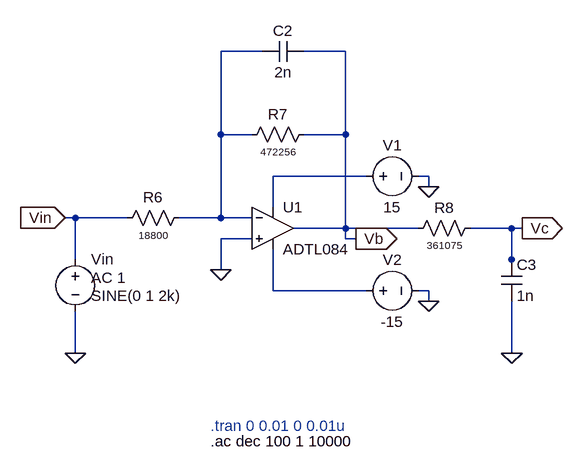
[diagram p0: schematic 2nd Order LPF.asc]
2nd Order LPF.asc, the LTspice schematic file:
Version 4
SHEET 1 880 680
WIRE 368 -176 304 -176
WIRE 496 -176 432 -176
WIRE 304 -48 304 -176
WIRE 352 -48 304 -48
WIRE 496 -48 496 -176
WIRE 496 -48 432 -48
WIRE 528 16 384 16
WIRE 624 16 608 16
WIRE 624 32 624 16
WIRE 384 64 384 16
WIRE 80 80 64 80
WIRE 160 80 80 80
WIRE 304 80 304 -48
WIRE 304 80 240 80
WIRE 352 80 304 80
WIRE 496 96 496 -48
WIRE 496 96 416 96
WIRE 608 96 496 96
WIRE 752 96 688 96
WIRE 768 96 752 96
WIRE 352 112 304 112
WIRE 496 112 496 96
WIRE 512 112 496 112
WIRE 80 144 80 80
WIRE 752 144 752 96
WIRE 304 160 304 112
WIRE 752 160 752 144
WIRE 384 192 384 128
WIRE 528 192 384 192
WIRE 624 192 608 192
WIRE 624 208 624 192
WIRE 80 288 80 224
WIRE 752 288 752 208
FLAG 80 288 0
FLAG 304 160 0
FLAG 752 288 0
FLAG 624 208 0
FLAG 624 32 0
FLAG 768 96 Vc
IOPIN 768 96 Out
FLAG 512 112 Vb
IOPIN 512 112 Out
FLAG 64 80 Vin
IOPIN 64 80 In
SYMBOL res 256 64 R90
WINDOW 0 0 56 VBottom 2
WINDOW 3 32 56 VTop 1
SYMATTR InstName R6
SYMATTR Value 18800
SYMBOL voltage 80 128 R0
WINDOW 3 24 72 Left 2
WINDOW 123 24 44 Left 2
WINDOW 39 0 0 Left 0
SYMATTR Value SINE(0 1 2k)
SYMATTR Value2 AC 1
SYMATTR InstName Vin
SYMBOL res 448 -64 R90
WINDOW 0 0 56 VBottom 2
WINDOW 3 32 56 VTop 1
SYMATTR InstName R7
SYMATTR Value 472256
SYMBOL cap 432 -192 R90
WINDOW 0 0 32 VBottom 2
WINDOW 3 32 32 VTop 2
SYMATTR InstName C2
SYMATTR Value 2n
SYMBOL res 704 80 R90
WINDOW 0 0 56 VBottom 2
WINDOW 3 32 56 VTop 1
SYMATTR InstName R8
SYMATTR Value 361075
SYMBOL cap 736 144 R0
SYMATTR InstName C3
SYMATTR Value 1n
SYMBOL voltage 512 16 R270
WINDOW 0 32 56 VTop 2
WINDOW 3 -32 56 VBottom 2
WINDOW 123 0 0 Left 0
WINDOW 39 0 0 Left 0
SYMATTR InstName V1
SYMATTR Value 15
SYMBOL voltage 512 192 R270
WINDOW 0 32 56 VTop 2
WINDOW 3 -32 56 VBottom 2
SYMATTR InstName V2
SYMATTR Value -15
SYMBOL OpAmps\\ADTL084 384 32 R0
SYMATTR InstName U1
TEXT 288 400 Left 2 ;.tran 0 0.01 0 0.01u
TEXT 288 424 Left 2 !.ac dec 100 1 10000

The netlist it stands for:
* 2nd Order LPF.asc
R6 N001 Vin 18800
Vin Vin 0 SINE(0 1 2k) AC 1
R7 Vb N001 472256
C2 Vb N001 2n
R8 Vc Vb 361075
C3 Vc 0 1n
V1 N002 0 15
V2 N003 0 -15
XU1 0 N001 N002 N003 Vb ADTL084  ; pins In+ In- V+ V- OUT
* .tran 0 0.01 0 0.01u
.ac dec 100 1 10000
.lib ADTL084.lib
.backanno
.end